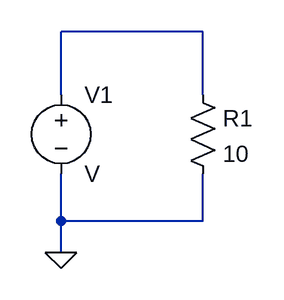
[diagram p0: schematic aula01.asc]
aula01.asc, the LTspice schematic file:
Version 4
SHEET 1 880 680
WIRE -208 352 -352 352
WIRE -352 416 -352 352
WIRE -208 416 -208 352
WIRE -352 544 -352 496
WIRE -208 544 -208 496
WIRE -208 544 -352 544
WIRE -352 576 -352 544
FLAG -352 576 0
SYMBOL res -224 400 R0
SYMATTR InstName R1
SYMATTR Value 10
SYMBOL voltage -352 400 R0
SYMATTR InstName V1

The netlist it stands for:
* aula01.asc
R1 N001 0 10
V1 N001 0 V
.backanno
.end